# EAGLE schematic Electric_schem (EAGLE 9.6.2)
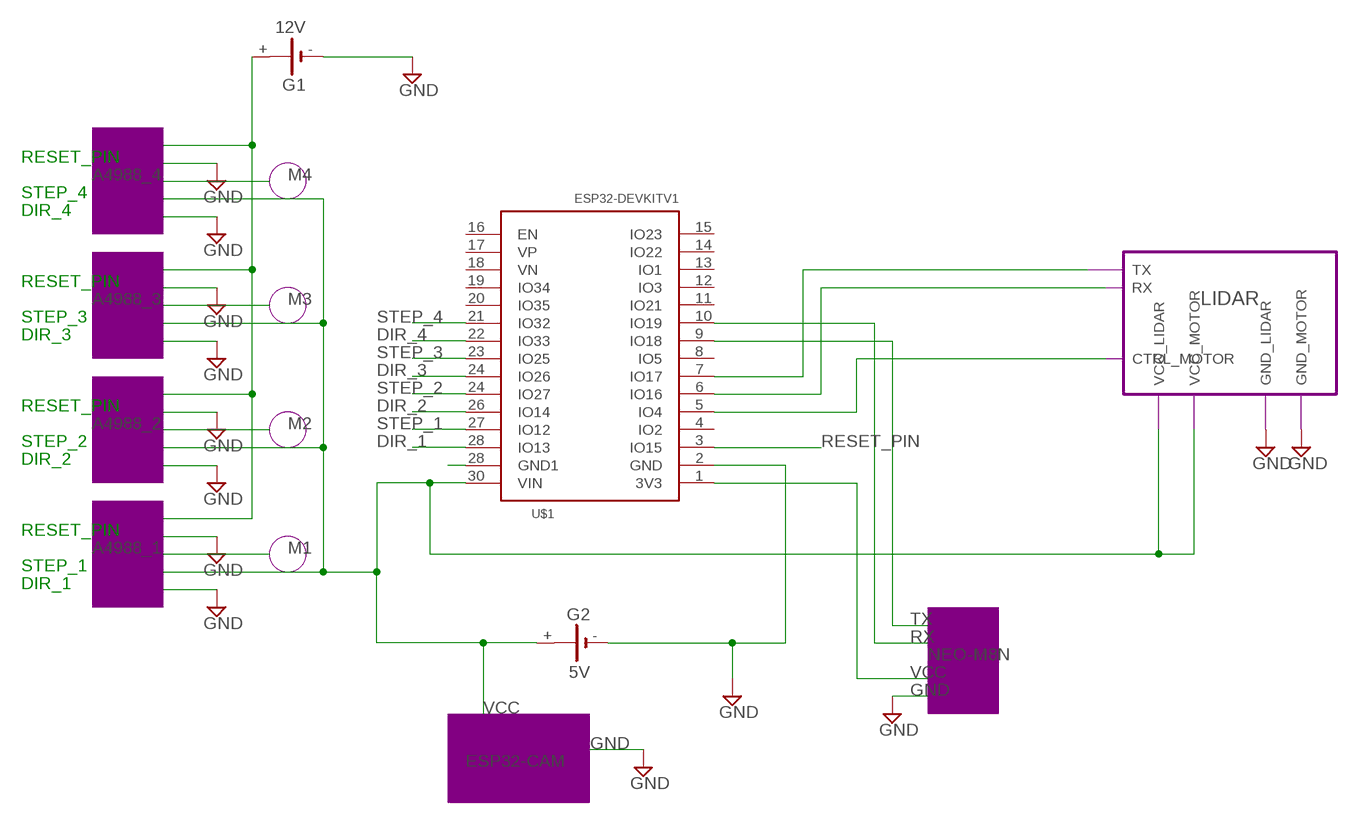
[diagram p0: schematic, sheet 1]

## Parts
G1  12V  CR-AA  [CRAA]
G2  CR1/2  [CR1/2]
U$1  ESP32DEVKITV1  [ESP32-DEVKITV1]

## Module instances
LIDAR = LIDAR

## Nets
DIR_1: U$1.28(IO13)
DIR_2: U$1.26(IO14)
DIR_3: U$1.24(IO26)
DIR_4: U$1.22(IO33)
GND: G1.- G2.- U$1.2(GND) ; port LIDAR.GND_LIDAR LIDAR.GND_MOTOR
N$2: U$1.7(IO17) ; port LIDAR.TX
N$3: U$1.6(IO16)
N$4: U$1.5(IO4)
N$8: G2.+ U$1.30(VIN) ; port LIDAR.VCC_LIDAR LIDAR.VCC_MOTOR
N$9: U$1.9(IO18)
N$10: U$1.28(GND1)
N$11: U$1.10(IO19)
N$12: U$1.1(3V3)
N$18: G1.+
RESET_PIN: U$1.3(IO15)
STEP_1: U$1.27(IO12)
STEP_2: U$1.24(IO27)
STEP_3: U$1.23(IO25)
STEP_4: U$1.21(IO32)
Unconnected: G1.+@1(+) G2.+@1(+) U$1.4(IO2) U$1.8(IO5) U$1.11(IO21) U$1.12(IO3) U$1.13(IO1) U$1.14(IO22) U$1.15(IO23) U$1.16(EN) U$1.17(VP) U$1.18(VN) U$1.19(IO34) U$1.20(IO35)

## Notes on the sheet
- RESET_PIN
- A4988_4 | M4
- STEP_4
- DIR_4
- RESET_PIN
- A4988_3 | M3
- STEP_3
- DIR_3
- RESET_PIN
- A4988_2 | M2
- STEP_2
- DIR_2
- RESET_PIN
- A4988_1 | M1
- STEP_1
- DIR_1
- TX
- RX
- NEO-M8N
- VCC
- GND
- VCC
- GND
- ESP32-CAM

## Library data of the parts
G1 = battery:CR-AA: LI BATTERY Varta CRAA-SLF
G2 = battery:CR1/2: LI BATTERY Sonnenschein SL-350 PT; 5V: 5V
U$1 = ESP32-DEVKITV1:ESP32DEVKITV1

## Module LIDAR
Ports: TX(out) RX(in) CTRL_MOTOR(out) VCC_LIDAR(io) VCC_MOTOR(io) GND_LIDAR(io) GND_MOTOR(io)

### Library data of the parts